# Altium schematic sheet main.SchDoc
size A4; SheetNumber: 1; SheetTotal: 3
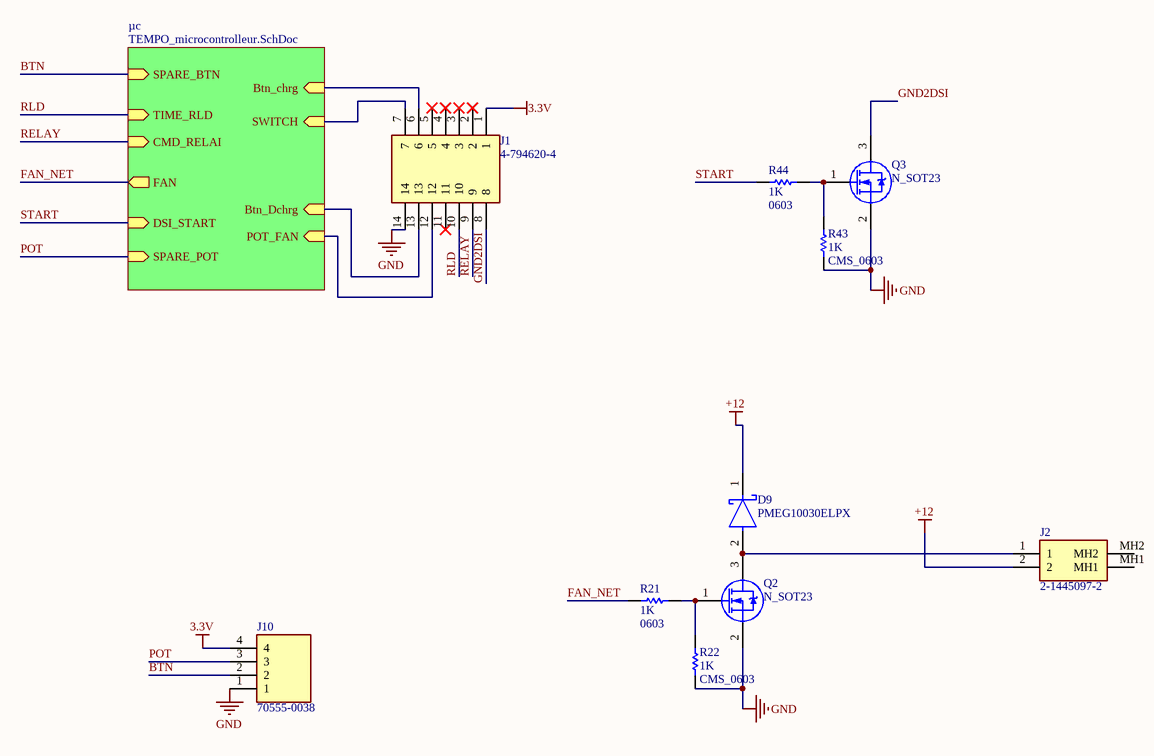
[diagram p0: main.SchDoc]

## Parts
D9  PMEG10030ELPX  [FP-SOD128-MFG]
J1  4-794620-4  [4-794620-4]
J2  2-1445097-2  [214450972]
J10  70555-0038  [705550038]
Q2  Package: N_SOT23  [TRANSISTOR_MOSFET-N_SOT23_GSD]  (hidden comment: TRANSISTOR_MOSFET-N_SOT23_GSD)
Q3  Package: N_SOT23  [TRANSISTOR_MOSFET-N_SOT23_GSD]  (hidden comment: TRANSISTOR_MOSFET-N_SOT23_GSD)
R21  value 1K  Type: 0603  [RESISTANCE_CMS_0603]  (hidden comment: RESISTANCE_CMS_0603)
R22  value 1K  Type: CMS_0603  [RESISTANCE_CMS_0603]  (hidden comment: RESISTANCE_CMS_0603)
R43  value 1K  Type: CMS_0603  [RESISTANCE_CMS_0603]  (hidden comment: RESISTANCE_CMS_0603)
R44  value 1K  Type: 0603  [RESISTANCE_CMS_0603]  (hidden comment: RESISTANCE_CMS_0603)

## Sub-sheets
µc = TEMPO_microcontrolleur.SchDoc: Btn_Dchrg (in), Btn_chrg (in), SWITCH (in), FAN (out), POT_FAN (in), CMD_RELAI (in), DSI_START (in), TIME_RLD (in), SPARE_POT (in), SPARE_BTN (in)

## Nets
3.3V: J1.1 J10.4
+12: D9.1(K) J2.2
GND: J1.14 J10.1 Q2.2(S) Q3.2(S) R22.2 R43.2
BTN: J10.2 ; sheet µc/SPARE_BTN
FAN_NET: R21.2 ; sheet µc/FAN
GND2DSI: J1.8 Q3.3(D)
POT: J10.3 ; sheet µc/SPARE_POT
RELAY: J1.9 ; sheet µc/CMD_RELAI
RLD: J1.10 ; sheet µc/TIME_RLD
START: R44.2 ; sheet µc/DSI_START
NetD9_2: D9.2(A) J2.1 Q2.3(D)
NetJ1_6: J1.6 ; sheet µc/Btn_chrg
NetJ1_7: J1.7 ; sheet µc/SWITCH
NetJ1_12: J1.12 ; sheet µc/POT_FAN
NetJ1_13: J1.13 ; sheet µc/Btn_Dchrg
NetQ2_1: Q2.1(G) R21.1 R22.1
NetQ3_1: Q3.1(G) R43.1 R44.1

Not connected (* = marked no-connect by the designer): J1 2* 3* 4* 5* 11*; J2 MH1 MH2

## Library data of the parts
D9 = CMP-14398-000022-1: DIODE SCHOTTKY 100V 3A SOD128
J1 = 4-794620-4: Connector; Manufacturer_Name: TE Connectivity; Datasheet Link: https://www.te.com/commerce/DocumentDelivery/DDEController?Action=srchrtrv&DocNm=1773458-4_MICRO_MATE_N_LOK&DocType=Data+Sheet&DocLang=English&PartCntxt=4-794620-4&DocFormat=pdf; Manufacturer_Part_Number: 4-794620-4; Mouser Part Number: 571-4-794620-4; Mouser Price/Stock: https://www.mouser.com/Search/Refine.aspx?Keyword=571-4-794620-4; Arrow Part Number: 4-794620-4; Arrow Price/Stock: https://www.arrow.com/en/products/4-794620-4/te-connectivity?region=nac
J2 = 2-1445097-2: MICRO MNL HDR ASSY S/ROW AU LF; Manufacturer_Name: TE Connectivity; Geometry.Height: 5.8mm; Mouser Part Number: 571-2-1445097-2; Mouser Price/Stock: https://www.mouser.co.uk/ProductDetail/TE-Connectivity-AMP/2-1445097-2?qs=WeHYKPpr%2FZjBFQqBJ1Kj7A%3D%3D; Manufacturer_Part_Number: 2-1445097-2; Datasheet Link: https://www.te.com/commerce/DocumentDelivery/DDEController?Action=showdoc&DocId=Customer+Drawing%7F1445097%7FA2%7Fpdf%7FEnglish%7FENG_CD_1445097_A2.pdf%7F2-1445097-2
J10 = 70555-0038: Connector; Manufacturer_Name: Molex; Allied_Number: 70091307; Datasheet Link: http://uk.rs-online.com/web/p/products/7978792P; Height: 7.25mm; RS Part Number: 7978792P; RS Price/Stock: http://uk.rs-online.com/web/p/products/7978792P; Manufacturer_Part_Number: 70555-0038
Q2 Q3 = TRANSISTOR_MOSFET-N_SOT23_GSD: TRANSISTOR MOSFET CANAL N BOITIER SOT23_GSD
R21 R22 R43 R44 = RESISTANCE_CMS_0603: RESISTANCE CMS 0603